# EAGLE design Main_Controller (EAGLE 9.6.2)
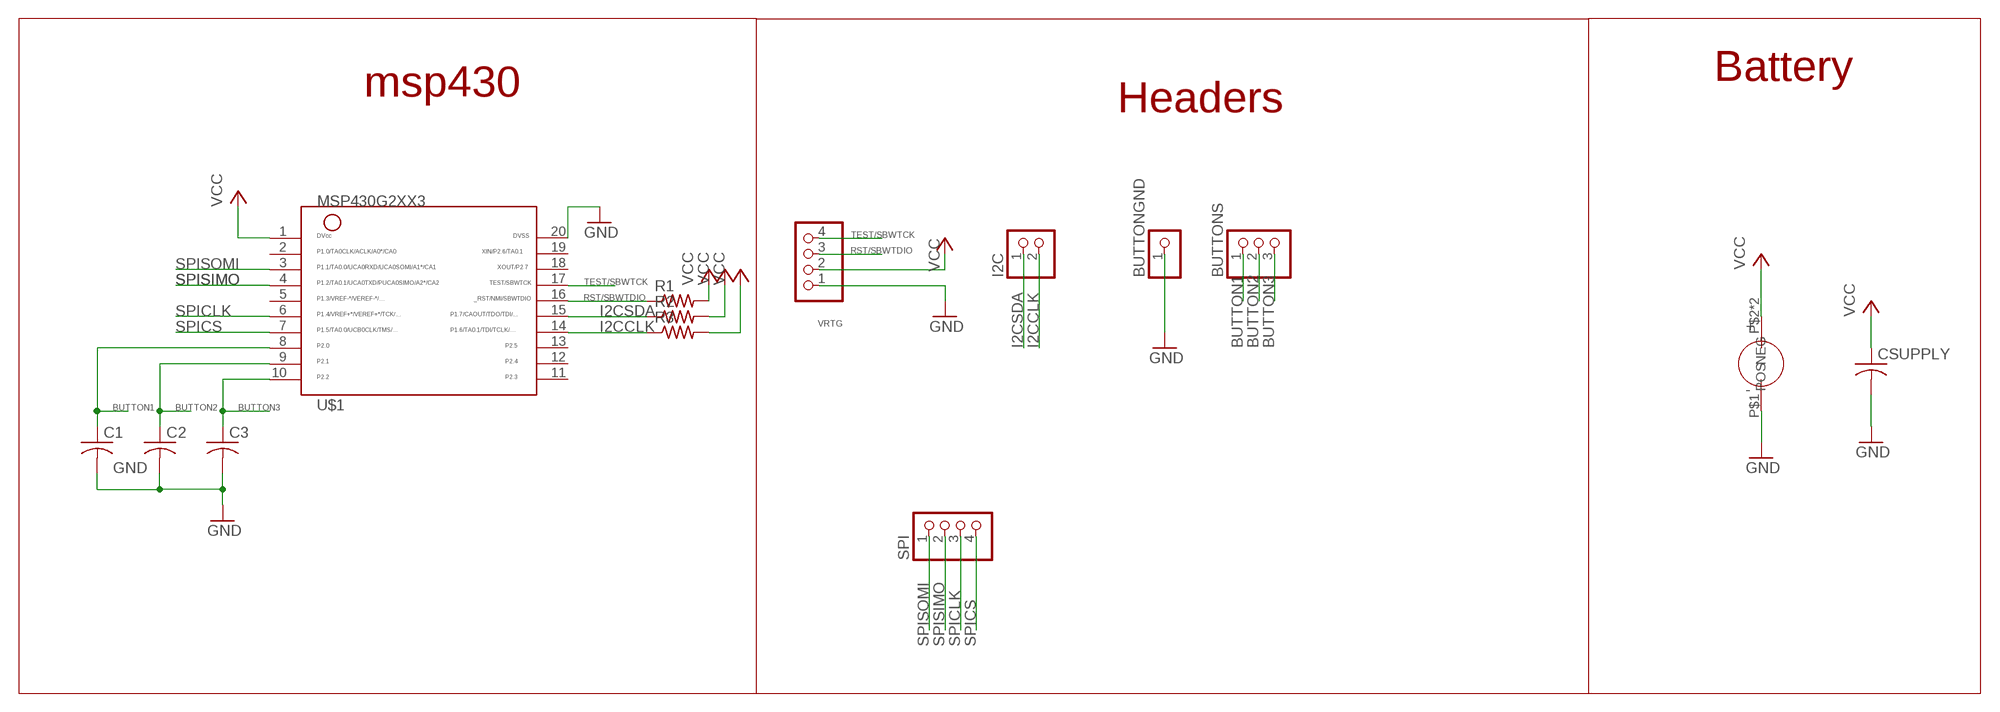
[diagram p0: schematic, sheet 1]

## Parts
BUTTONGND  PINHD-1X1  [1X01]
BUTTONS  PINHD-1X3  [1X03]
C1  C-USC1206  [C1206]
C2  C-USC1206  [C1206]
C3  C-USC1206  [C1206]
CSUPPLY  C-USC1206  [C1206]
I2C  PINHD-1X2  [1X02]
R1  R-US_R1206  [R1206]
R2  R-US_R1206  [R1206]
R3  R-US_R1206  [R1206]
SPI  PINHD-1X4  [1X04]
U$1  MSP430G2XX3TSSOP  [PW20]
U$2  3002BATTERY  [3002BATTERY]
VRTG  PINHD-1X4  [1X04]

## Nets
BUTTON1: BUTTONS.1 C1.1 U$1.8
BUTTON2: BUTTONS.2 C2.1 U$1.9
BUTTON3: BUTTONS.3 C3.1 U$1.10
GND: BUTTONGND.1 C1.2 C2.2 C3.2 CSUPPLY.2 U$1.20 U$2.P$1(NEG) VRTG.1
I2CCLK: I2C.2 R3.1 U$1.14
I2CSDA: I2C.1 R2.1 U$1.15
RST/SBWTDIO: R1.1 U$1.16 VRTG.3
SPICLK: SPI.3 U$1.6
SPICS: SPI.4 U$1.7
SPISIMO: SPI.2 U$1.4
SPISOMI: SPI.1 U$1.3
TEST/SBWTCK: U$1.17 VRTG.4
VCC: CSUPPLY.1 R1.2 R2.2 R3.2 U$1.1 U$2.P$2(POS) U$2.P$3(POS) VRTG.2
Unconnected: U$1.2 U$1.5 U$1.11 U$1.12 U$1.13 U$1.18 U$1.19

## Notes on the sheet
- Battery
- msp430
- Headers

## Library data of the parts
BUTTONGND = pinhead:PINHD-1X1: PIN HEADER
BUTTONS = pinhead:PINHD-1X3: PIN HEADER
C1-C3 CSUPPLY = rcl:C-US: CAPACITOR, American symbol; SPICEPREFIX: C
I2C = pinhead:PINHD-1X2: PIN HEADER
R1-R3 = rcl:R-US_: RESISTOR, American symbol; SPICEPREFIX: R
SPI VRTG = pinhead:PINHD-1X4: PIN HEADER
U$1 = ELEC327:MSP430G2XX3: MSP430G2XX3 PDIP (N) 20 Pin Package
U$2 = Personal:3002BATTERY: 3002 Battery Holder Digikey <https://www.digikey.com/en/products/detail/keystone-electronics/3002/227444> Drawing <https://www.digikey.com/htmldatasheets/production/846798/0/0/1/3002-drawing.html>

## Board
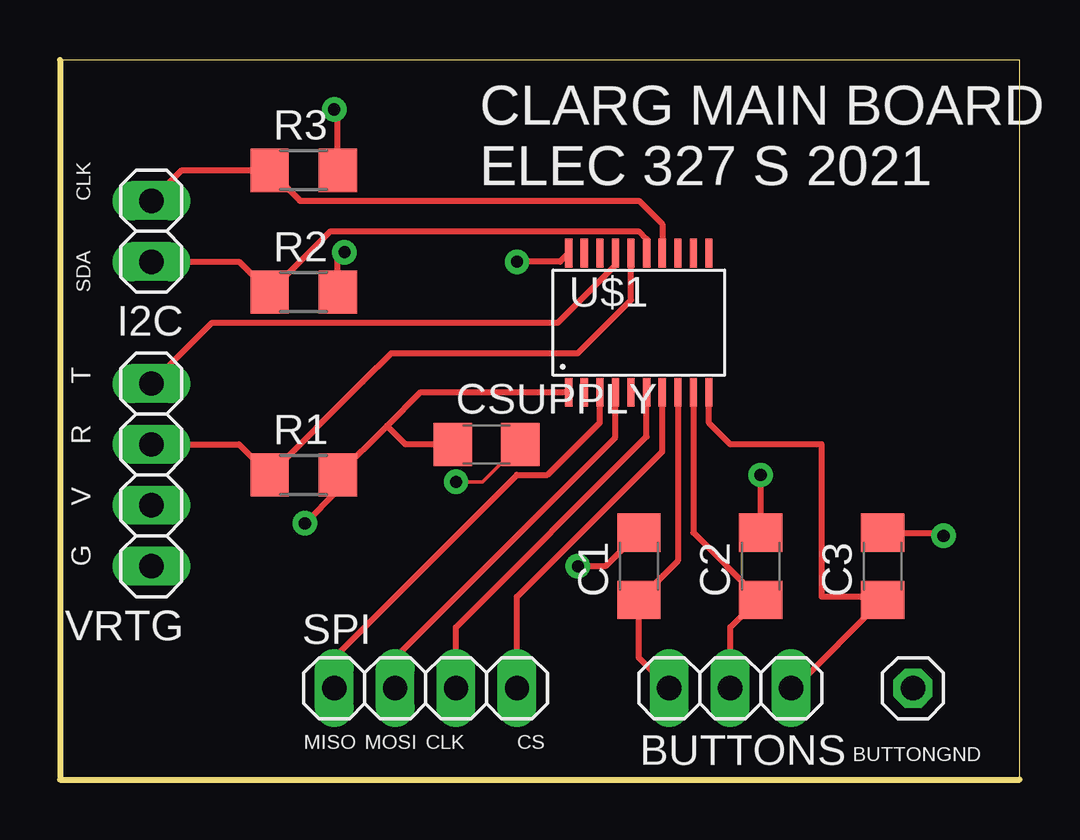
[diagram p1: board, top side]
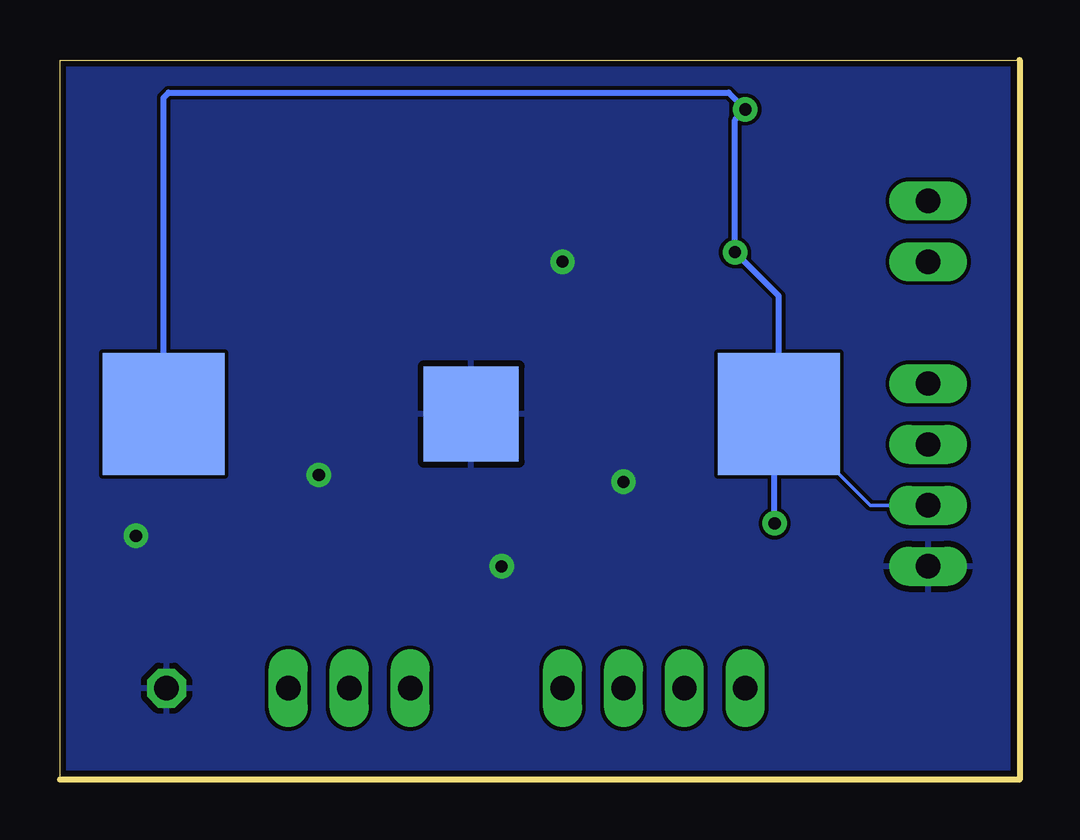
[diagram p2: board, bottom side, seen from below]

Size 40 x 30 mm. Coordinates in mm from the lower left corner, seen from the top.
Outline: 0,0 40,0 40,30 0,30 0,0
Copper layers (1*16): Top 0.035mm / dielectric 1.5mm / Bottom 0.035mm
Design rules "AdvancedCircuitsBarebones": minimum track width 6mil, minimum drill 20mil, track to track 6mil, track to pad 6mil, pad to pad 6mil, via to via 6mil, smd to smd 6mil, copper to edge 10mil, drill to drill 6mil, minimum pad ring 12mil, minimum via ring 10mil, stop-mask expansion 4mil, vias tented up to drill 25mil, thermal gap 10mil

### Footprints (pad centres in the part's own frame; a part is rotated, then mirrored left to right if it is on the bottom)
1X01 = drill 1.016 octagon: 1 0,0
1X03 = drill 1.016 long: 1 -2.54,0; 2 0,0; 3 2.54,0
C1206 = smd 1.6 x 1.8: 1 -1.4,0; 2 1.4,0
1X02 = drill 1.016 long: 1 -1.27,0; 2 1.27,0
R1206 = smd 1.6 x 1.803: 1 -1.422,0; 2 1.422,0
1X04 = drill 1.016 long: 1 -3.81,0; 2 -1.27,0; 3 1.27,0; 4 3.81,0
PW20 = smd 0.3 x 1.2: 1 -2.925,-2.9; 2 -2.275,-2.9; 3 -1.625,-2.9; 4 -0.975,-2.9; 5 -0.325,-2.9; 6 0.325,-2.9; 7 0.975,-2.9; 8 1.625,-2.9; 9 2.275,-2.9; 10 2.925,-2.9; 11 2.925,2.9; 12 2.275,2.9; 13 1.625,2.9; 14 0.975,2.9; 15 0.325,2.9; 16 -0.325,2.9; 17 -0.975,2.9; 18 -1.625,2.9; 19 -2.275,2.9; 20 -2.925,2.9
3002BATTERY = smd 3.96 x 3.96: P$1 0,0 | smd 5.08 x 5.08: P$2 12.825,0; P$3 -12.825,0

### Placement (x,y rotation side)
BUTTONGND  35.56,3.81 0 top
BUTTONS  27.94,3.81 0 top
C1  24.13,8.89 90 top
C2  29.21,8.89 90 top
C3  34.29,8.89 90 top
CSUPPLY  17.78,13.97 0 top
I2C  3.81,22.86 90 top
R1  10.16,12.7 0 top
R2  10.16,20.32 0 top
R3  10.16,25.4 0 top
SPI  15.24,3.81 0 top
U$1  24.13,19.05 0 top
U$2  22.86,15.24 0 bottom
VRTG  3.81,12.7 90 top

### Tracks (layer width: path | path; a pad name or v marks a point on that pad's centre or on a via)
BUTTON1
  Top 0.254: BUTTONS.1 24.13,5.08 C1.1 25.75,9.12 U$1.8
BUTTON2
  Top 0.254: U$1.9 26.41,10.29 29.14,7.55 | 29.14,7.55 C2.1 | BUTTONS.2 27.94,6.35 29.14,7.55
BUTTON3
  Top 0.254: BUTTONS.3 30.61,3.81 C3.1 34.16,7.62 31.75,7.62 31.75,13.97 27.94,13.97 27.05,14.86 U$1.10
GND  (via drill 0.51, 0.51 pad 0.65)
  Top 0.152: CSUPPLY.2 17.62,12.41 v16.51,12.41
  Top 0.254: C3.2 36.7,10.29 v36.83,10.16 | C2.2 v29.21,12.7 | C1.2 22.73,8.89 v21.59,8.89 | U$1.20 20.84,21.59 v19.05,21.59
  pour Bottom: 0,0 0,30 40,30 40,0
I2CCLK
  Top 0.254: I2C.2 5.08,25.4 R3.1 10.01,24.13 24.13,24.13 25.11,23.16 U$1.14
I2CSDA
  Top 0.254: I2C.1 7.47,21.59 R2.1 11.28,22.86 24.13,22.86 24.45,22.54 U$1.15
RST/SBWTDIO
  Top 0.254: VRTG.3 7.47,13.97 R1.1 12.62,16.59 13.82,17.78 21.59,17.78 23.8,20 U$1.16
SPICLK
  Top 0.254: SPI.3 16.51,6.35 24.45,14.29 U$1.6
SPICS
  Top 0.254: SPI.4 19.05,7.62 25.11,13.68 U$1.7
SPISIMO
  Top 0.254: SPI.2 13.97,5.08 23.16,14.27 U$1.4
SPISOMI
  Top 0.254: SPI.1 11.43,5.08 19.05,12.7 20.32,12.7 22.5,14.88 U$1.3
TEST/SBWTCK
  Top 0.254: VRTG.4 6.35,19.05 20.75,19.05 23.16,21.45 U$1.17
VCC  (via drill 0.51)
  Top 0.254: 13.63,14.74 R1.2 11.58,12.05 v10.21,10.68 | R2.2 11.58,21.7 v11.86,21.98 | 13.63,14.74 15.03,16.15 U$1.1 | CSUPPLY.1 14.4,13.97 13.63,14.74 | R3.2 11.58,27.79 v11.43,27.94
  Bottom 0.152: U$2.P$2 9.81,15.02 6.22,11.43 VRTG.2
  Bottom 0.254: U$2.P$3 35.69,28.43 35.47,28.64 12.13,28.64 v11.43,27.94 11.86,27.51 v11.86,21.98 10.04,20.16 U$2.P$2 | v10.21,10.68 10.21,14.62 9.81,15.02

### Text on the board
tPlace: CLARG MAIN BOARD / ELEC 327 S 2021 | CLK | SDA | T | R | V | G | MISO | MOSI | CLK | CS